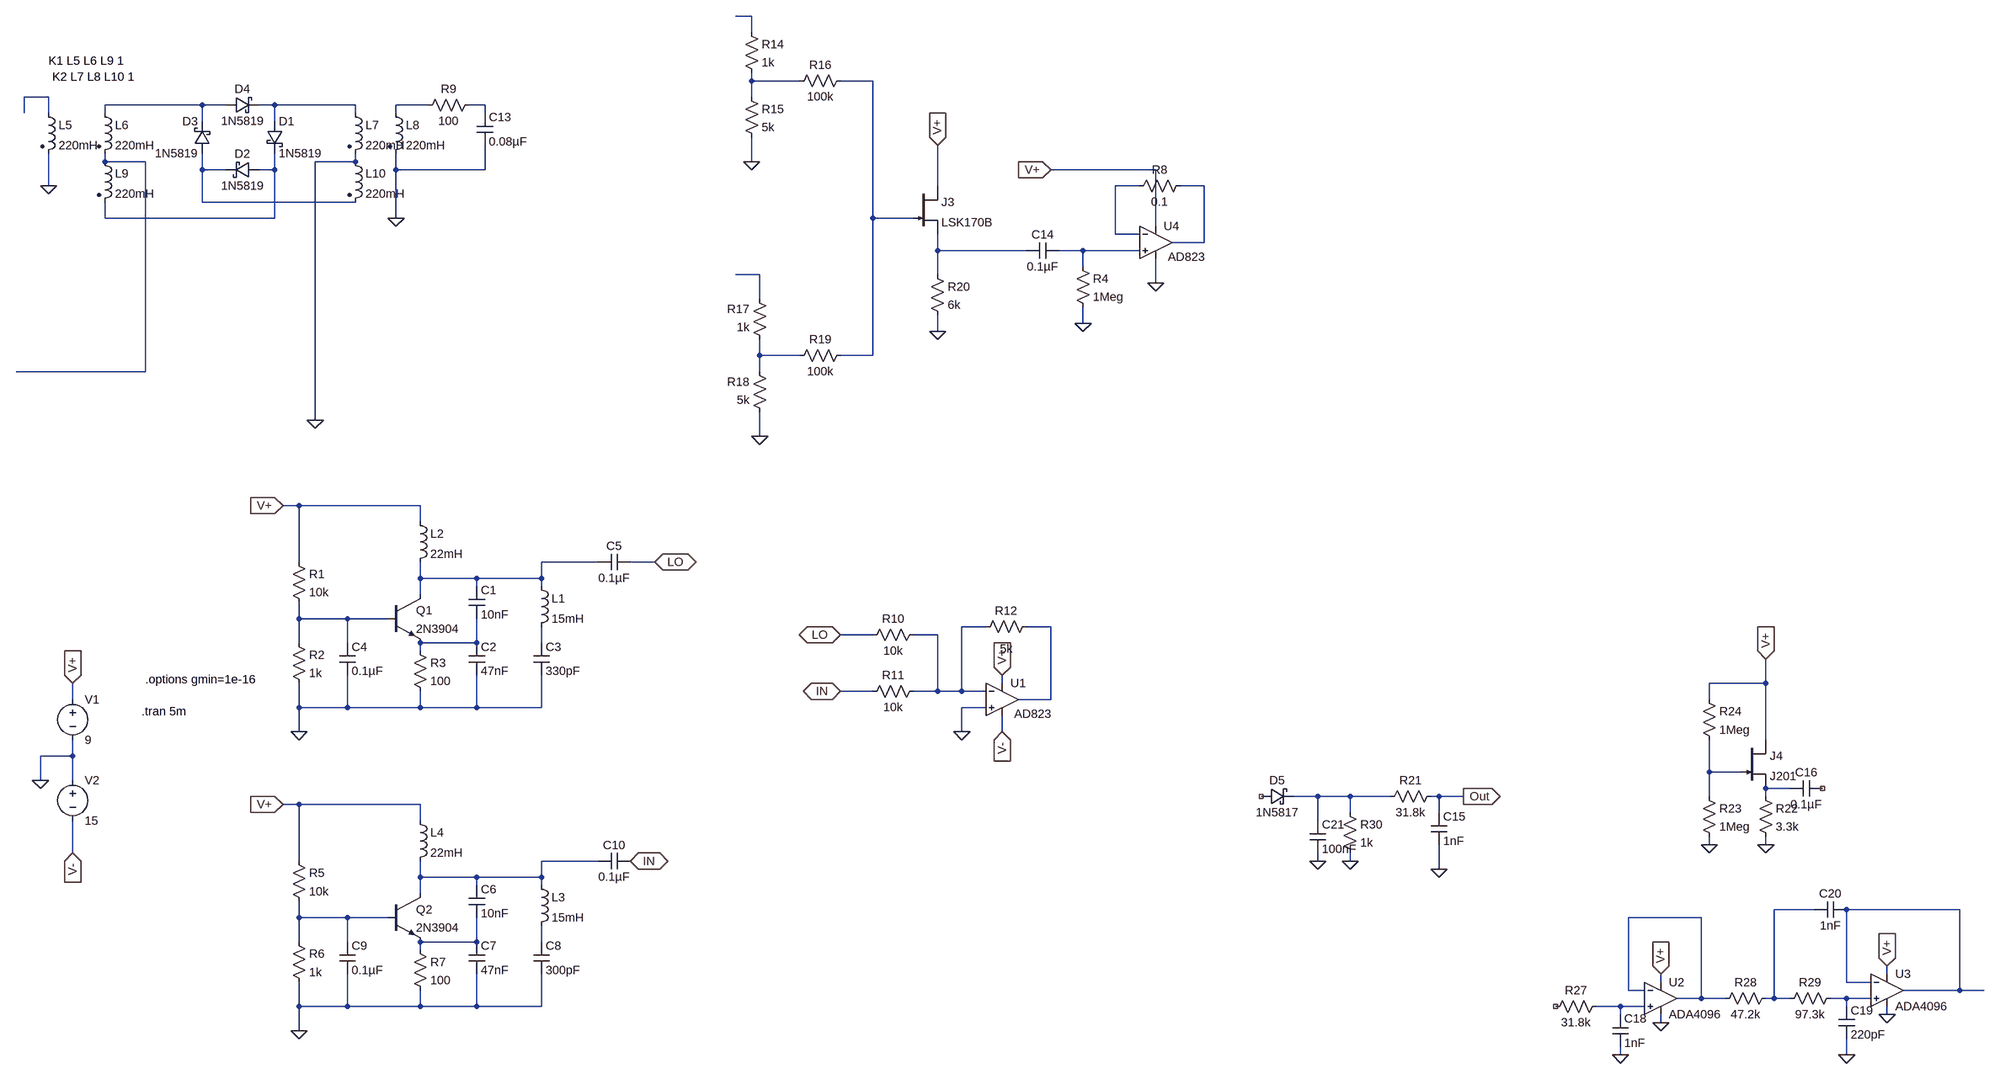
[diagram p0: schematic Draft1.asc]
Draft1.asc, the LTspice schematic file:
Version 4
SHEET 1 4036 1492
WIRE 1328 -1120 1296 -1120
WIRE 1328 -1088 1328 -1120
WIRE 1328 -992 1328 -1008
WIRE 1424 -992 1328 -992
WIRE 1568 -992 1504 -992
WIRE -64 -960 -112 -960
WIRE 1328 -960 1328 -992
WIRE 240 -944 48 -944
WIRE 288 -944 240 -944
WIRE 384 -944 352 -944
WIRE 544 -944 384 -944
WIRE 688 -944 624 -944
WIRE 800 -944 768 -944
WIRE -112 -928 -112 -960
WIRE -64 -928 -64 -960
WIRE 48 -928 48 -944
WIRE 544 -928 544 -944
WIRE 624 -928 624 -944
WIRE 800 -928 800 -944
WIRE 240 -912 240 -944
WIRE 384 -912 384 -944
WIRE 48 -832 48 -848
WIRE 128 -832 48 -832
WIRE 544 -832 544 -848
WIRE 544 -832 464 -832
WIRE 1328 -832 1328 -880
WIRE 240 -816 240 -848
WIRE 288 -816 240 -816
WIRE 384 -816 384 -848
WIRE 384 -816 352 -816
WIRE 624 -816 624 -848
WIRE 800 -816 800 -864
WIRE 800 -816 624 -816
WIRE 2128 -816 1920 -816
WIRE -64 -784 -64 -848
WIRE 1696 -784 1696 -864
WIRE 2096 -784 2048 -784
WIRE 2224 -784 2176 -784
WIRE 240 -752 240 -816
WIRE 544 -752 240 -752
WIRE 48 -720 48 -752
WIRE 384 -720 384 -816
WIRE 384 -720 48 -720
WIRE 624 -720 624 -816
WIRE 1568 -720 1568 -992
WIRE 1648 -720 1568 -720
WIRE 2128 -704 2128 -816
WIRE 2048 -688 2048 -784
WIRE 2096 -688 2048 -688
WIRE 2224 -672 2224 -784
WIRE 2224 -672 2160 -672
WIRE 1696 -656 1696 -688
WIRE 1872 -656 1696 -656
WIRE 1984 -656 1936 -656
WIRE 2096 -656 1984 -656
WIRE 1984 -624 1984 -656
WIRE 1344 -608 1296 -608
WIRE 1696 -608 1696 -656
WIRE 2128 -592 2128 -640
WIRE 1344 -560 1344 -608
WIRE 1984 -512 1984 -544
WIRE 1696 -496 1696 -528
WIRE 1344 -448 1344 -480
WIRE 1424 -448 1344 -448
WIRE 1568 -448 1568 -720
WIRE 1568 -448 1504 -448
WIRE 128 -416 128 -832
WIRE 128 -416 -128 -416
WIRE 1344 -416 1344 -448
WIRE 464 -320 464 -832
WIRE 1344 -288 1344 -336
WIRE 432 64 400 64
WIRE 672 64 432 64
WIRE 672 96 672 64
WIRE 432 176 432 64
WIRE 1024 176 912 176
WIRE 1136 176 1088 176
WIRE 672 208 672 176
WIRE 784 208 672 208
WIRE 912 208 912 176
WIRE 912 208 784 208
WIRE 784 224 784 208
WIRE 912 224 912 208
WIRE 672 240 672 208
WIRE 432 288 432 256
WIRE 528 288 432 288
WIRE 608 288 528 288
WIRE 1792 304 1744 304
WIRE 1920 304 1872 304
WIRE 1568 320 1504 320
WIRE 1696 320 1648 320
WIRE 432 336 432 288
WIRE 528 336 528 288
WIRE 784 336 784 288
WIRE 784 336 672 336
WIRE 912 336 912 304
WIRE 672 352 672 336
WIRE 1824 416 1824 400
WIRE 3504 416 3504 368
WIRE 3504 416 3392 416
WIRE 1568 432 1504 432
WIRE 1696 432 1696 320
WIRE 1696 432 1648 432
WIRE 1744 432 1744 304
WIRE 1744 432 1696 432
WIRE 1792 432 1744 432
WIRE -16 448 -16 416
WIRE 1920 448 1920 304
WIRE 1920 448 1856 448
WIRE 3392 448 3392 416
WIRE 432 464 432 416
WIRE 528 464 528 400
WIRE 528 464 432 464
WIRE 672 464 672 432
WIRE 672 464 528 464
WIRE 784 464 784 400
WIRE 784 464 672 464
WIRE 912 464 912 400
WIRE 912 464 784 464
WIRE 1792 464 1744 464
WIRE 432 512 432 464
WIRE 1744 512 1744 464
WIRE 1824 512 1824 480
WIRE 3504 528 3504 416
WIRE -16 560 -16 528
WIRE -16 560 -80 560
WIRE 3392 592 3392 528
WIRE 3456 592 3392 592
WIRE -80 608 -80 560
WIRE -16 608 -16 560
WIRE 3552 624 3504 624
WIRE 2592 640 2544 640
WIRE 2656 640 2592 640
WIRE 2736 640 2656 640
WIRE 2832 640 2816 640
WIRE 2880 640 2832 640
WIRE 3392 640 3392 592
WIRE 3504 640 3504 624
WIRE 432 656 400 656
WIRE 672 656 432 656
WIRE 2656 672 2656 640
WIRE 2832 672 2832 640
WIRE 672 688 672 656
WIRE 2592 688 2592 640
WIRE 3392 736 3392 720
WIRE 3504 736 3504 720
WIRE -16 752 -16 688
WIRE 432 768 432 656
WIRE 1024 768 912 768
WIRE 2592 768 2592 752
WIRE 2656 768 2656 752
WIRE 2832 784 2832 736
WIRE 672 800 672 768
WIRE 784 800 672 800
WIRE 912 800 912 768
WIRE 912 800 784 800
WIRE 784 816 784 800
WIRE 912 816 912 800
WIRE 672 832 672 800
WIRE 3600 864 3520 864
WIRE 3888 864 3664 864
WIRE 432 880 432 848
WIRE 528 880 432 880
WIRE 608 880 528 880
WIRE 3376 880 3232 880
WIRE 432 928 432 880
WIRE 528 928 528 880
WIRE 784 928 784 880
WIRE 784 928 672 928
WIRE 912 928 912 896
WIRE 672 944 672 928
WIRE 3744 992 3744 976
WIRE 3296 1008 3296 992
WIRE 3664 1008 3664 864
WIRE 3712 1008 3664 1008
WIRE 3232 1024 3232 880
WIRE 3264 1024 3232 1024
WIRE 3888 1024 3888 864
WIRE 3888 1024 3776 1024
WIRE 3936 1024 3888 1024
WIRE 3376 1040 3376 880
WIRE 3376 1040 3328 1040
WIRE 3424 1040 3376 1040
WIRE 3520 1040 3520 864
WIRE 3520 1040 3504 1040
WIRE 3552 1040 3520 1040
WIRE 3664 1040 3632 1040
WIRE 3712 1040 3664 1040
WIRE 432 1056 432 1008
WIRE 528 1056 528 992
WIRE 528 1056 432 1056
WIRE 672 1056 672 1024
WIRE 672 1056 528 1056
WIRE 784 1056 784 992
WIRE 784 1056 672 1056
WIRE 912 1056 912 992
WIRE 912 1056 784 1056
WIRE 3216 1056 3168 1056
WIRE 3264 1056 3216 1056
WIRE 3664 1056 3664 1040
WIRE 3216 1072 3216 1056
WIRE 3744 1072 3744 1056
WIRE 3296 1088 3296 1072
WIRE 432 1104 432 1056
WIRE 3216 1152 3216 1136
WIRE 3664 1152 3664 1120
FLAG 624 -720 0
FLAG -64 -784 0
FLAG 464 -320 0
FLAG 1328 -832 0
FLAG 1344 -288 0
FLAG 3504 736 0
FLAG 432 512 0
FLAG 432 1104 0
FLAG -16 416 V+
IOPIN -16 416 In
FLAG 400 64 V+
IOPIN 400 64 In
FLAG 400 656 V+
IOPIN 400 656 In
FLAG 1504 320 LO
IOPIN 1504 320 BiDir
FLAG 1136 176 LO
IOPIN 1136 176 BiDir
FLAG 1088 768 IN
IOPIN 1088 768 BiDir
FLAG 1504 432 IN
IOPIN 1504 432 BiDir
FLAG 1696 -864 V+
IOPIN 1696 -864 In
FLAG 2880 640 Out
IOPIN 2880 640 Out
FLAG 2832 784 0
FLAG 3504 368 V+
IOPIN 3504 368 In
FLAG 3392 736 0
FLAG 2128 -592 0
FLAG 1920 -816 V+
IOPIN 1920 -816 In
FLAG 3664 1152 0
FLAG 3296 992 V+
IOPIN 3296 992 In
FLAG 3744 976 V+
IOPIN 3744 976 In
FLAG 3216 1152 0
FLAG -80 608 0
FLAG -16 752 V-
IOPIN -16 752 In
FLAG 1696 -496 0
FLAG 3296 1088 0
FLAG 3744 1072 0
FLAG 2592 768 0
FLAG 2656 768 0
FLAG 1984 -512 0
FLAG 1824 512 V-
IOPIN 1824 512 In
FLAG 1824 400 V+
IOPIN 1824 400 In
FLAG 1744 512 0
SYMBOL res 416 160 R0
SYMATTR InstName R1
SYMATTR Value 10k
SYMBOL res 416 320 R0
SYMATTR InstName R2
SYMATTR Value 1k
SYMBOL npn 608 240 R0
SYMATTR InstName Q1
SYMATTR Value 2N3904
SYMBOL res 656 336 R0
SYMATTR InstName R3
SYMATTR Value 100
SYMBOL ind 896 208 R0
SYMATTR InstName L1
SYMATTR Value 15mH
SYMBOL voltage -16 432 R0
WINDOW 123 0 0 Left 0
WINDOW 39 0 0 Left 0
SYMATTR InstName V1
SYMATTR Value 9
SYMBOL cap 768 224 R0
SYMATTR InstName C1
SYMATTR Value 10nF
SYMBOL cap 768 336 R0
SYMATTR InstName C2
SYMATTR Value 47nF
SYMBOL cap 896 336 R0
SYMATTR InstName C3
SYMATTR Value 330pF
SYMBOL cap 512 336 R0
SYMATTR InstName C4
SYMATTR Value 0.1µF
SYMBOL cap 1088 160 R90
WINDOW 0 0 32 VBottom 2
WINDOW 3 32 32 VTop 2
SYMATTR InstName C5
SYMATTR Value 0.1µF
SYMBOL res 416 752 R0
SYMATTR InstName R5
SYMATTR Value 10k
SYMBOL res 416 912 R0
SYMATTR InstName R6
SYMATTR Value 1k
SYMBOL npn 608 832 R0
SYMATTR InstName Q2
SYMATTR Value 2N3904
SYMBOL res 656 928 R0
SYMATTR InstName R7
SYMATTR Value 100
SYMBOL ind 896 800 R0
SYMATTR InstName L3
SYMATTR Value 15mH
SYMBOL ind 656 672 R0
SYMATTR InstName L4
SYMATTR Value 22mH
SYMBOL cap 768 816 R0
SYMATTR InstName C6
SYMATTR Value 10nF
SYMBOL cap 768 928 R0
SYMATTR InstName C7
SYMATTR Value 47nF
SYMBOL cap 896 928 R0
SYMATTR InstName C8
SYMATTR Value 300pF
SYMBOL cap 512 928 R0
SYMATTR InstName C9
SYMATTR Value 0.1µF
SYMBOL cap 1088 752 R90
WINDOW 0 0 32 VBottom 2
WINDOW 3 32 32 VTop 2
SYMATTR InstName C10
SYMATTR Value 0.1µF
SYMBOL schottky 368 -912 R0
SYMATTR InstName D1
SYMATTR Value 1N5819
SYMATTR Description Diode
SYMATTR Type diode
SYMBOL schottky 352 -832 R90
WINDOW 0 0 32 VBottom 2
WINDOW 3 32 32 VTop 2
SYMATTR InstName D2
SYMATTR Value 1N5819
SYMATTR Description Diode
SYMATTR Type diode
SYMBOL schottky 256 -848 R180
WINDOW 0 24 64 Left 2
WINDOW 3 24 0 Left 2
SYMATTR InstName D3
SYMATTR Value 1N5819
SYMATTR Description Diode
SYMATTR Type diode
SYMBOL schottky 288 -928 R270
WINDOW 0 32 32 VTop 2
WINDOW 3 0 32 VBottom 2
SYMATTR InstName D4
SYMATTR Value 1N5819
SYMATTR Description Diode
SYMATTR Type diode
SYMBOL ind2 -80 -944 R0
SYMATTR InstName L5
SYMATTR Value 220mH
SYMATTR Type ind
SYMBOL ind2 32 -944 R0
SYMATTR InstName L6
SYMATTR Value 220mH
SYMATTR Type ind
SYMBOL ind2 528 -944 R0
SYMATTR InstName L7
SYMATTR Value 220mH
SYMATTR Type ind
SYMBOL ind2 608 -944 R0
SYMATTR InstName L8
SYMATTR Value 220mH
SYMATTR Type ind
SYMBOL ind2 32 -848 R0
SYMATTR InstName L9
SYMATTR Value 220mH
SYMATTR Type ind
SYMBOL ind2 528 -848 R0
SYMATTR InstName L10
SYMATTR Value 220mH
SYMATTR Type ind
SYMBOL res 784 -960 R90
WINDOW 0 0 56 VBottom 2
WINDOW 3 32 56 VTop 2
SYMATTR InstName R9
SYMATTR Value 100
SYMBOL cap 784 -928 R0
SYMATTR InstName C13
SYMATTR Value 0.08µF
SYMBOL njf 1648 -784 R0
SYMATTR InstName J3
SYMATTR Value LSK170B
SYMBOL res 1312 -1104 R0
SYMATTR InstName R14
SYMATTR Value 1k
SYMBOL res 1312 -976 R0
SYMATTR InstName R15
SYMATTR Value 5k
SYMBOL res 1520 -1008 R90
WINDOW 0 0 56 VBottom 2
WINDOW 3 32 56 VTop 2
SYMATTR InstName R16
SYMATTR Value 100k
SYMBOL res 1360 -464 R180
WINDOW 0 36 76 Left 2
WINDOW 3 36 40 Left 2
SYMATTR InstName R17
SYMATTR Value 1k
SYMBOL res 1360 -320 R180
WINDOW 0 36 76 Left 2
WINDOW 3 36 40 Left 2
SYMATTR InstName R18
SYMATTR Value 5k
SYMBOL res 1408 -432 R270
WINDOW 0 32 56 VTop 2
WINDOW 3 0 56 VBottom 2
SYMATTR InstName R19
SYMATTR Value 100k
SYMBOL res 1680 -624 R0
SYMATTR InstName R20
SYMATTR Value 6k
SYMBOL cap 1936 -672 R90
WINDOW 0 0 32 VBottom 2
WINDOW 3 32 32 VTop 2
SYMATTR InstName C14
SYMATTR Value 0.1µF
SYMBOL cap 2816 672 R0
SYMATTR InstName C15
SYMATTR Value 1nF
SYMBOL res 2832 624 R90
WINDOW 0 0 56 VBottom 2
WINDOW 3 32 56 VTop 2
SYMATTR InstName R21
SYMATTR Value 31.8k
SYMBOL njf 3456 528 R0
SYMATTR InstName J4
SYMATTR Value J201
SYMBOL res 3488 624 R0
SYMATTR InstName R22
SYMATTR Value 3.3k
SYMBOL res 3376 624 R0
SYMATTR InstName R23
SYMATTR Value 1Meg
SYMBOL cap 3616 608 R90
WINDOW 0 0 32 VBottom 2
WINDOW 3 32 32 VTop 2
SYMATTR InstName C16
SYMATTR Value 0.1µF
SYMBOL res 3376 432 R0
SYMATTR InstName R24
SYMATTR Value 1Meg
SYMBOL ind 656 80 R0
SYMATTR InstName L2
SYMATTR Value 22mH
SYMBOL OpAmps\\ADA4096 3296 976 R0
SYMATTR InstName U2
SYMBOL res 3184 1040 R90
WINDOW 0 0 56 VBottom 2
WINDOW 3 32 56 VTop 2
SYMATTR InstName R27
SYMATTR Value 31.8k
SYMBOL OpAmps\\ADA4096 3744 960 R0
SYMATTR InstName U3
SYMBOL cap 3200 1072 R0
SYMATTR InstName C18
SYMATTR Value 1nF
SYMBOL res 3520 1024 R90
WINDOW 0 0 56 VBottom 2
WINDOW 3 32 56 VTop 2
SYMATTR InstName R28
SYMATTR Value 47.2k
SYMBOL res 3536 1056 R270
WINDOW 0 32 56 VTop 2
WINDOW 3 0 56 VBottom 2
SYMATTR InstName R29
SYMATTR Value 97.3k
SYMBOL cap 3648 1056 R0
SYMATTR InstName C19
SYMATTR Value 220pF
SYMBOL cap 3664 848 R90
WINDOW 0 0 32 VBottom 2
WINDOW 3 32 32 VTop 2
SYMATTR InstName C20
SYMATTR Value 1nF
SYMBOL voltage -16 592 R0
WINDOW 123 0 0 Left 0
WINDOW 39 0 0 Left 0
SYMATTR InstName V2
SYMATTR Value 15
SYMBOL schottky 2480 656 R270
WINDOW 0 32 32 VTop 2
WINDOW 3 0 32 VBottom 2
SYMATTR InstName D5
SYMATTR Value 1N5817
SYMATTR Description Diode
SYMATTR Type diode
SYMBOL cap 2576 688 R0
SYMATTR InstName C21
SYMATTR Value 100nF
SYMBOL res 2640 656 R0
SYMATTR InstName R30
SYMATTR Value 1k
SYMBOL res 1968 -640 R0
SYMATTR InstName R4
SYMATTR Value 1Meg
SYMBOL res 2192 -800 R90
WINDOW 0 0 56 VBottom 2
WINDOW 3 32 56 VTop 2
SYMATTR InstName R8
SYMATTR Value 0.1
SYMBOL OpAmps\\AD823 2128 -736 R0
WINDOW 3 24 93 Left 2
SYMATTR InstName U4
SYMBOL OpAmps\\AD823 1824 384 R0
WINDOW 3 24 93 Left 2
SYMATTR InstName U1
SYMBOL res 1664 304 R90
WINDOW 0 0 56 VBottom 2
WINDOW 3 32 56 VTop 2
SYMATTR InstName R10
SYMATTR Value 10k
SYMBOL res 1664 416 R90
WINDOW 0 0 56 VBottom 2
WINDOW 3 32 56 VTop 2
SYMATTR InstName R11
SYMATTR Value 10k
SYMBOL res 1888 288 R90
WINDOW 0 0 56 VBottom 2
WINDOW 3 44 56 VTop 2
SYMATTR InstName R12
SYMATTR Value 5k
TEXT 120 472 Left 2 !.tran 5m
TEXT -64 -1032 Left 2 !K1 L5 L6 L9 1
TEXT -56 -1000 Left 2 !K2 L7 L8 L10 1
TEXT 128 408 Left 2 !.options gmin=1e-16

The netlist it stands for:
* Draft1.asc
R1 V+ N019 10k
R2 N019 0 1k
Q1 N018 N019 N022 0 2N3904
R3 N022 0 100
L1 N018 N023 15mH
V1 V+ 0 9
C1 N018 N022 10nF
C2 N022 0 47nF
C3 N023 0 330pF
C4 N019 0 0.1µF
C5 LO N018 0.1µF
R5 V+ N030 10k
R6 N030 0 1k
Q2 N027 N030 N032 0 2N3904
R7 N032 0 100
L3 N027 N033 15mH
L4 V+ N027 22mH
C6 N027 N032 10nF
C7 N032 0 47nF
C8 N033 0 300pF
C9 N030 0 0.1µF
C10 IN N027 0.1µF
D1 N006 N011 1N5819
D2 N011 N010 1N5819
D3 N010 N005 1N5819
D4 N005 N006 1N5819
L5 N004 0 220mH
L6 N005 N009 220mH
L7 N006 0 220mH
L8 N007 0 220mH
L9 N009 N011 220mH
L10 0 N010 220mH
R9 N008 N007 100
C13 N008 0 0.08µF
J3 V+ N003 N014 LSK170B
R14 N001 N002 1k
R15 N002 0 5k
R16 N003 N002 100k
R17 N017 N016 1k
R18 0 N017 5k
R19 N017 N003 100k
R20 N014 0 6k
C14 N015 N014 0.1µF
C15 Out 0 1nF
R21 Out N026 31.8k
J4 V+ N024 N025 J201
R22 N025 0 3.3k
R23 N024 0 1Meg
C16 NC_01 N025 0.1µF
R24 V+ N024 1Meg
L2 V+ N018 22mH
XU2 N035 N031 V+ 0 N031 ADA4096  ; pins In+ In- V+ V- OUT
R27 N035 NC_02 31.8k
XU3 N034 N029 V+ 0 N029 ADA4096  ; pins In+ In- V+ V- OUT
C18 N035 0 1nF
R28 N028 N031 47.2k
R29 N028 N034 97.3k
C19 N034 0 220pF
C20 N029 N028 1nF
V2 0 V- 15
D5 NC_03 N026 1N5817
C21 N026 0 100nF
R30 N026 0 1k
R4 N015 0 1Meg
R8 N013 N012 0.1
XU4 N015 N012 V+ 0 N013 AD823  ; pins In+ In- V+ V- OUT
XU1 0 N020 V+ V- N021 AD823  ; pins In+ In- V+ V- OUT
R10 N020 LO 10k
R11 N020 IN 10k
R12 N021 N020 5k
.model D D
.lib standard.dio
.model NPN NPN
.model PNP PNP
.lib standard.bjt
.model NJF NJF
.model PJF PJF
.lib standard.jft
.tran 5m
K1 L5 L6 L9 1
K2 L7 L8 L10 1
.options gmin=1e-16
.lib ADI.lib
.backanno
.end